# Altium project msp.PrjPcb
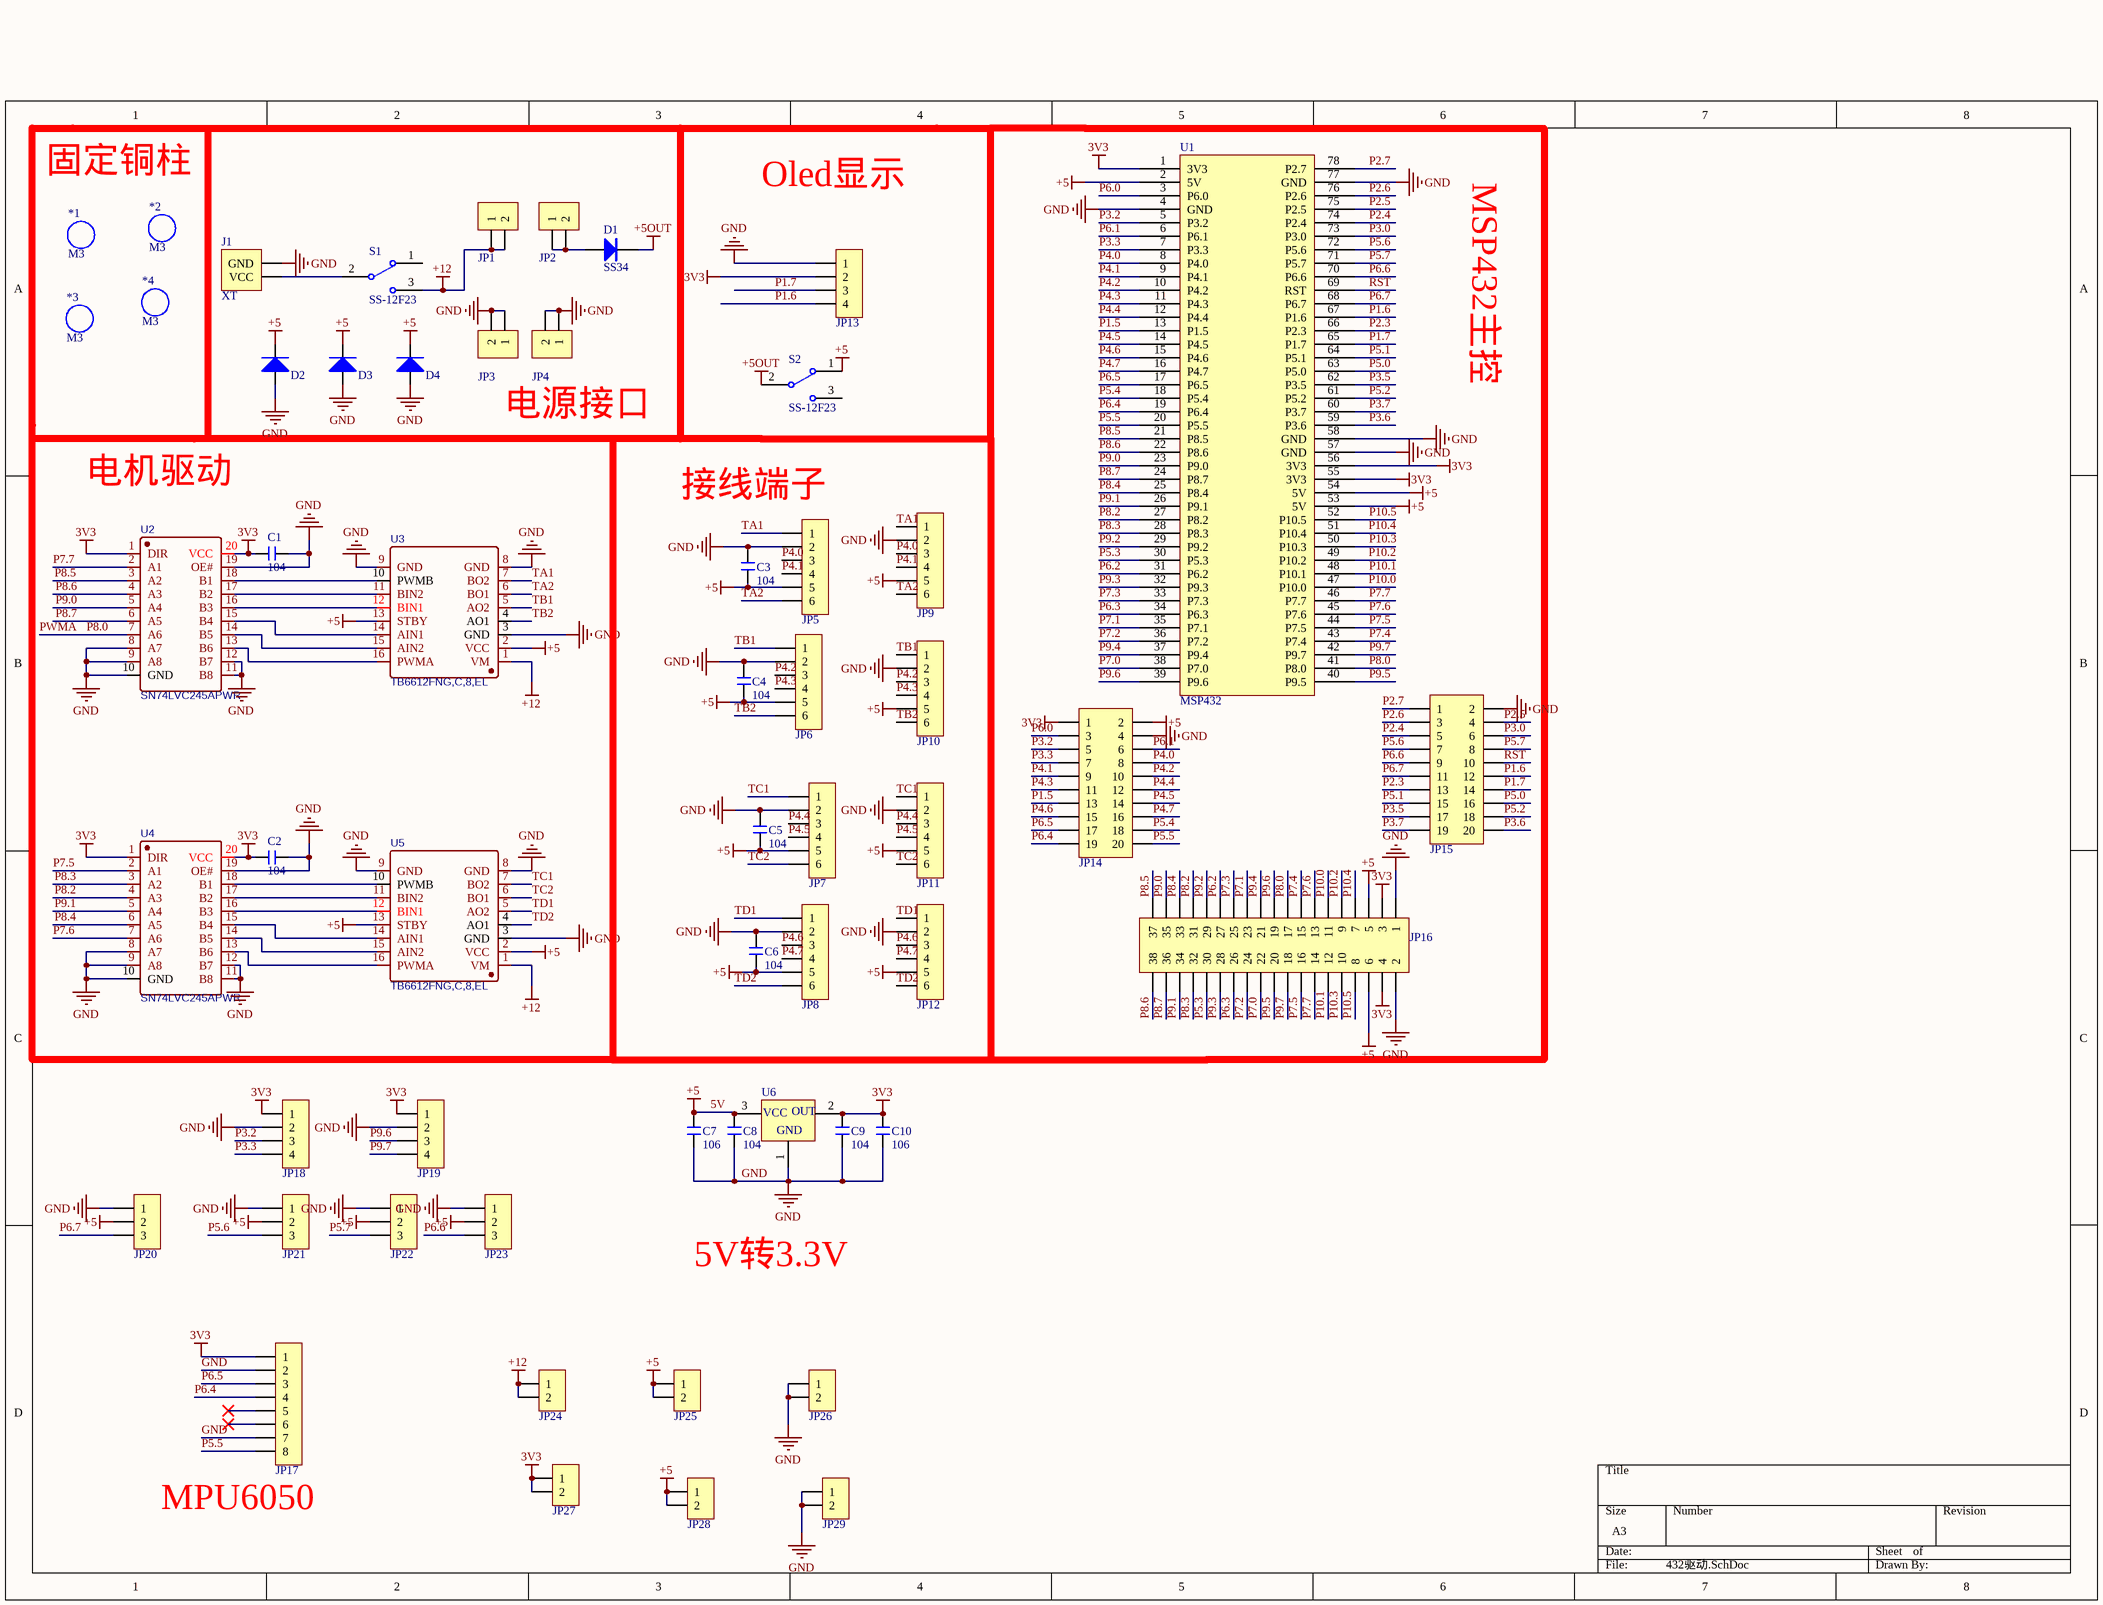
[diagram p0: 432驱动.SchDoc]
1 sheet, 56 parts. Net scope: global (net labels, ports and power ports of the same name join across sheets).
Board file: msp432.PcbDoc

## Sheet 432驱动.SchDoc
size A3

### Parts
*1  M3  [M3 125X300]
*2  M3  [M3 125X300]
*3  M3  [M3 125X300]
*4  M3  [M3 125X300]
C1  104  [C 0603]
C2  104  [C 0603]
C3  104  [C 0603_M]
C4  104  [C 0603_M]
C5  104  [C 0603_M]
C6  104  [C 0603_M]
C7  106  [C 0805_M]
C8  104  [C 0805_L]
C9  104  [C 0805_L]
C10  106  [C 0805_M]
D1  SS34  [SMC]
D2  TVS  [SMB]  (value not drawn)
D3  TVS  [SMB]  (value not drawn)
D4  TVS  [SMB]  (value not drawn)
J1  XT  [T-SET]
JP1  HDR-1X2  [HDR2.54-M-LI-2P]  (value not drawn)
JP2  HDR-1X2  [HDR2.54-M-LI-2P]  (value not drawn)
JP3  HDR-1X2  [HDR2.54-M-LI-2P]  (value not drawn)
JP4  HDR-1X2  [HDR2.54-M-LI-2P]  (value not drawn)
JP5  HDR-1X6  [PH2.0-WI-6P]  (value not drawn)
JP6  HDR-1X6  [PH2.0-WI-6P]  (value not drawn)
JP7  HDR-1X6  [PH2.0-WI-6P]  (value not drawn)
JP8  HDR-1X6  [PH2.0-WI-6P]  (value not drawn)
JP9  HDR-1X6  [XH2.54-WI-6P]  (value not drawn)
JP10  HDR-1X6  [XH2.54-WI-6P]  (value not drawn)
JP11  HDR-1X6  [XH2.54-WI-6P]  (value not drawn)
JP12  HDR-1X6  [XH2.54-WI-6P]  (value not drawn)
JP13  HDR-1X4  [HDR2.54-M-LI-4P]  (value not drawn)
JP14  Header 2X10  [HDR2.54-LI-2x10P]  (value not drawn)
JP15  Header 2X10  [HDR2.54-LI-2x10P]  (value not drawn)
JP16  Header 2X11  [HDR2.54-LI-2x19P]  (value not drawn)
JP17  HDR-1X8  [HDR2.54-M-LI-8P]  (value not drawn)
JP18  HDR-1X4  [HDR2.54-LI-4P]  (value not drawn)
JP19  HDR-1X4  [HDR2.54-LI-4P]  (value not drawn)
JP20  HDR-1X3  [HDR2.54-LI-3P]  (value not drawn)
JP21  HDR-1X3  [HDR2.54-LI-3P]  (value not drawn)
JP22  HDR-1X3  [HDR2.54-LI-3P]  (value not drawn)
JP23  HDR-1X3  [HDR2.54-LI-3P]  (value not drawn)
JP24  HDR-1X2  [HDR2.54-M-LI-2P]  (value not drawn)
JP25  HDR-1X2  [HDR2.54-M-LI-2P]  (value not drawn)
JP26  HDR-1X2  [HDR2.54-M-LI-2P]  (value not drawn)
JP27  HDR-1X2  [HDR2.54-M-LI-2P]  (value not drawn)
JP28  HDR-1X2  [HDR2.54-M-LI-2P]  (value not drawn)
JP29  HDR-1X2  [HDR2.54-M-LI-2P]  (value not drawn)
S1  SS-12F23  [SS-12F23]
S2  SS-12F23  [SS-12F23]
U1  MSP432  [msp432]
U2  SN74LVC245APWR  [TTSOP]
U3  TB6612FNG,C,8,EL  [PCBComponent_1 - duplicate]
U4  SN74LVC245APWR  [TTSOP]
U5  TB6612FNG,C,8,EL  [PCBComponent_1 - duplicate]
U6  (no value)  [SOT-223]

### Blocks framed on the sheet
固定铜柱: *1-*4

### Nets
3V3: C1.1 C2.1 C9.2 C10.2 JP13.2 JP14.1 JP16.3 JP16.4 JP17.1 JP18.1 JP19.1 JP27.1 JP27.2 U1.1(3V3) U1.55(3V3) U1.56(3V3) U2.1(DIR) U2.20(VCC) U4.1(DIR) U4.20(VCC) U6.2
5V: C3.1 C4.1 C5.1 C6.1 C7.2 C8.2 D2.2(K) D3.2(K) D4.2(K) JP5.5 JP6.5 JP7.5 JP8.5 JP9.5 JP10.5 JP11.5 JP12.5 JP14.2 JP16.5 JP16.6 JP20.2 JP21.2 JP22.2 JP23.2 JP25.1 JP25.2 JP28.1 JP28.2 S2.1 U1.2(5V) U1.53(5V) U1.54(5V) U3.2(VCC) U3.13(STBY) U5.2(VCC) U5.13(STBY) U6.3  [also labelled +5]
+5OUT: D1.2(K) S2.2
+12: JP1.1 JP1.2 JP24.1 JP24.2 S1.3 U3.1(VM) U5.1(VM)
GND: C1.2 C2.2 C3.2 C4.2 C5.2 C6.2 C7.1 C8.1 C9.1 C10.1 D2.1(A) D3.1(A) D4.1(A) J1.2(GND) JP3.1 JP3.2 JP4.1 JP4.2 JP5.2 JP6.2 JP7.2 JP8.2 JP9.2 JP10.2 JP11.2 JP12.2 JP13.1 JP14.4 JP15.2 JP16.1 JP16.2 JP17.2 JP17.7 JP18.2 JP19.2 JP20.1 JP21.1 JP22.1 JP23.1 JP26.1 JP26.2 JP29.1 JP29.2 U1.4(GND) U1.57(GND) U1.58(GND) U1.77(GND) U2.8(A7) U2.9(A8) U2.10(GND) U2.11(B8) U2.12(B7) U2.19(OE#) U3.3(GND) U3.8(GND) U3.9(GND) U4.8(A7) U4.9(A8) U4.10(GND) U4.11(B8) U4.12(B7) U4.19(OE#) U5.3(GND) U5.8(GND) U5.9(GND) U6.1
P1.5: JP14.13 U1.13(P1.5)
P1.6: JP13.4 JP15.12 U1.67(P1.6)
P1.7: JP13.3 JP15.14 U1.65(P1.7)
P2.3: JP15.13 U1.66(P2.3)
P2.4: JP15.5 U1.74(P2.4)
P2.5: JP15.4 U1.75(P2.5)
P2.6: JP15.3 U1.76(P2.6)
P2.7: JP15.1 U1.78(P2.7)
P3.0: JP15.6 U1.73(P3.0)
P3.2: JP14.5 JP18.3 U1.5(P3.2)
P3.3: JP14.7 JP18.4 U1.7(P3.3)
P3.5: JP15.17 U1.62(P3.5)
P3.6: JP15.20 U1.59(P3.6)
P3.7: JP15.19 U1.60(P3.7)
P4.0: JP5.3 JP9.3 JP14.8 U1.8(P4.0)
P4.1: JP5.4 JP9.4 JP14.9 U1.9(P4.1)
P4.2: JP6.3 JP10.3 JP14.10 U1.10(P4.2)
P4.3: JP6.4 JP10.4 JP14.11 U1.11(P4.3)
P4.4: JP7.3 JP11.3 JP14.12 U1.12(P4.4)
P4.5: JP7.4 JP11.4 JP14.14 U1.14(P4.5)
P4.6: JP8.3 JP12.3 JP14.15 U1.15(P4.6)
P4.7: JP8.4 JP12.4 JP14.16 U1.16(P4.7)
P5.0: JP15.16 U1.63(P5.0)
P5.1: JP15.15 U1.64(P5.1)
P5.2: JP15.18 U1.61(P5.2)
P5.3: JP16.30 U1.30(P5.3)
P5.4: JP14.18 U1.18(P5.4)
P5.5: JP14.20 JP17.8 U1.20(P5.5)
P5.6: JP15.7 JP21.3 U1.72(P5.6)
P5.7: JP15.8 JP22.3 U1.71(P5.7)
P6.0: JP14.3 U1.3(P6.0)
P6.1: JP14.6 U1.6(P6.1)
P6.2: JP16.27 U1.31(P6.2)
P6.3: JP16.26 U1.34(P6.3)
P6.4: JP14.19 JP17.4 U1.19(P6.4)
P6.5: JP14.17 JP17.3 U1.17(P6.5)
P6.6: JP15.9 JP23.3 U1.70(P6.6)
P6.7: JP15.11 JP20.3 U1.68(P6.7)
P7.0: JP16.22 U1.38(P7.0)
P7.1: JP16.23 U1.35(P7.1)
P7.2: JP16.24 U1.36(P7.2)
P7.3: JP16.25 U1.33(P7.3)
P7.4: JP16.15 U1.43(P7.4)
P7.5: JP16.16 U1.44(P7.5) U4.2(A1)
P7.6: JP16.13 U1.45(P7.6) U4.7(A6)
P7.7: JP16.14 U1.46(P7.7) U2.2(A1)
P8.0: JP16.17 U1.41(P8.0) U2.7(A6)  [also labelled PWMA]
P8.2: JP16.31 U1.27(P8.2) U4.4(A3)
P8.3: JP16.32 U1.28(P8.3) U4.3(A2)
P8.4: JP16.33 U1.25(P8.4) U4.6(A5)
P8.5: JP16.37 U1.21(P8.5) U2.3(A2)
P8.6: JP16.38 U1.22(P8.6) U2.4(A3)
P8.7: JP16.36 U1.24(P8.7) U2.6(A5)
P9.0: JP16.35 U1.23(P9.0) U2.5(A4)
P9.1: JP16.34 U1.26(P9.1) U4.5(A4)
P9.2: JP16.29 U1.29(P9.2)
P9.3: JP16.28 U1.32(P9.3)
P9.4: JP16.21 U1.37(P9.4)
P9.5: JP16.20 U1.40(P9.5)
P9.6: JP16.19 JP19.3 U1.39(P9.6)
P9.7: JP16.18 JP19.4 U1.42(P9.7)
P10.0: JP16.11 U1.47(P10.0)
P10.1: JP16.12 U1.48(P10.1)
P10.2: JP16.9 U1.49(P10.2)
P10.3: JP16.10 U1.50(P10.3)
P10.4: JP16.7 U1.51(P10.4)
P10.5: JP16.8 U1.52(P10.5)
RST: JP15.10 U1.69(RST)
TA1: JP5.1 JP9.1 U3.7(BO2)
TA2: JP5.6 JP9.6 U3.6(BO1)
TB1: JP6.1 JP10.1 U3.5(AO2)
TB2: JP6.6 JP10.6 U3.4(AO1)
TC1: JP7.1 JP11.1 U5.7(BO2)
TC2: JP7.6 JP11.6 U5.6(BO1)
TD1: JP8.1 JP12.1 U5.5(AO2)
TD2: JP8.6 JP12.6 U5.4(AO1)
NetD1_1: D1.1(A) JP2.1 JP2.2
NetJ1_1: J1.1(VCC) S1.2
NetU2_13: U2.13(B6) U3.16(PWMA)
NetU2_14: U2.14(B5) U3.15(AIN2)
NetU2_15: U2.15(B4) U3.14(AIN1)
NetU2_16: U2.16(B3) U3.12(BIN1)
NetU2_17: U2.17(B2) U3.11(BIN2)
NetU2_18: U2.18(B1) U3.10(PWMB)
NetU4_13: U4.13(B6) U5.16(PWMA)
NetU4_14: U4.14(B5) U5.15(AIN2)
NetU4_15: U4.15(B4) U5.14(AIN1)
NetU4_16: U4.16(B3) U5.12(BIN1)
NetU4_17: U4.17(B2) U5.11(BIN2)
NetU4_18: U4.18(B1) U5.10(PWMB)

Not connected (* = marked no-connect by the designer): JP17 5* 6*; S1 1; S2 3

### Notes on the sheet
- Oled显示
- MSP432主控
- 电源接口
- 电机驱动
- 接线端子
- 5V转3.3V
- (near JP17) MPU6050
- (in symbol Component_1) VCC; OUT; GND

### Library data of the parts
*1-*4 = M3: 铜柱孔; 版权归属: 黎明电子style; BOM名称: 铜柱孔; 学习资源: https://lmdzstyle.taobao.com/
C1-C6 = C: 无极性贴片电容; 版权归属: 黎明电子style; BOM名称: 无极性贴片电容; 学习资源: https://lmdzstyle.taobao.com/
C7-C10 = C: 贴片电容; BOM名称: 无极性贴片电容; 淘宝ID: 封装库来自淘宝 ID：黄晶宝石; 联系售后，技术支持: https://shop463601444.taobao.com; 唯一出售店铺网址: https://shop463601444.taobao.com
D1 = SS34: 肖特基二极管; 版权归属: 源创客; 属性: 40V/3A; BOM名称: 肖特基二极管; 学习资源: www.ooocke.com
D2-D4 = TVS: TVS保护; Type: E6.8CA; Published: 8-Jun-2000; LatestRevisionDate: 17-Jul-2002; LatestRevisionNote: Re-released for DXP Platform.; PackageDocument: Sep-1996; PackageReference: SMC; Publisher: Altium Limited; Code_JEDEC: DO-214-AB
J1 = XT: 航模电池接口; BOM: 航模电池接口
JP1-JP4 JP24-JP29 = Header 2: 2P接插件; 版权归属: 黎明电子style; BOM名称: 2P接插件; 学习资源: https://lmdzstyle.taobao.com/
JP5-JP8 = Header 6: 6P接插件; 版权归属: 源创客; BOM名称: 6P接插件; 学习资源: www.ooocke.com
JP9-JP12 = Header 6: 6P接插件; 版权归属: 黎明电子style; BOM名称: 6P接插件; 学习资源: https://lmdzstyle.taobao.com/
JP13 JP18 JP19 = Header 4: 4P接插件; 版权归属: 封装库来自淘宝 ID：黄晶宝石; BOM名称: 4P接插件; 学习资源: https://shop463601444.taobao.com
JP14 JP15 = Header 10X2: 10*2P接插件; 版权归属: 源创客; BOM名称: 10*2P接插件; 学习资源: www.ooocke.com
JP16 = Header 19X2: 19*2P接插件; 版权归属: 封装库来自淘宝 ID：黄晶宝石; BOM名称: 19*2P接插件; 学习资源: https://shop463601444.taobao.com
JP17 = Header 8: 8P接插件; 版权归属: 封装库来自淘宝 ID：黄晶宝石; BOM名称: 8P接插件; 学习资源: https://shop463601444.taobao.com
JP20-JP23 = Header 3: 3P接插件; 版权归属: 封装库来自淘宝 ID：黄晶宝石; BOM名称: 3P接插件; 学习资源: https://shop463601444.taobao.com
S1 S2 = SSW-1P: 1路波动开关; BOM名称: 波动开关; 版权归属: 黎明电子style; 学习资源: https://lmdzstyle.taobao.com/
U1 = MSP432: 适配msp432官方
U2 U4 = SN74LVC245APWR: BOM_Manufacturer: TI; spicePre: X; BOM_Supplier: LCSC; BOM_Manufacturer Part: SN74LVC245APWR; BOM_Supplier Part: C7848; BOM_JLCPCB Part Class: Extended Part; spiceSymbolName: SN74LVC245APWR
U3 U5 = TB6612FNG,C,8,EL: BOM_Manufacturer: TOSHIBA; Contributor: LCSC; BOM_Supplier: LCSC; BOM_Manufacturer Part: TB6612FNG,C,8,EL; BOM_Supplier Part: C141517; BOM_JLCPCB Part Class: Extended Part; spicePre: U; spiceSymbolName: TB6612FNG,C,8,EL
U6 = Component_1